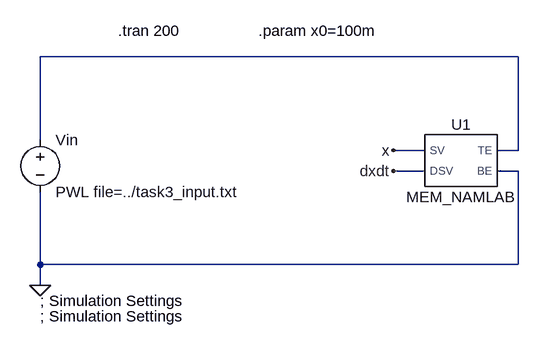
[diagram p0: schematic task3.asc]
task3.asc, the LTspice schematic file:
Version 4
SHEET 1 1352 680
WIRE 528 -160 -208 -160
WIRE -208 -32 -208 -160
WIRE 384 -16 336 -16
WIRE 528 -16 528 -160
WIRE 528 -16 496 -16
WIRE 384 16 336 16
WIRE 528 16 496 16
WIRE -208 160 -208 48
WIRE 528 160 528 16
WIRE 528 160 -208 160
WIRE -208 192 -208 160
FLAG -208 192 0
FLAG 336 -16 x
FLAG 336 16 dxdt
SYMBOL voltage -208 -48 R0
WINDOW 123 0 0 Left 0
WINDOW 39 0 0 Left 0
SYMATTR InstName Vin
SYMATTR Value PWL file=../task3_input.txt
SYMBOL MEM_NAMLAB 432 0 R0
SYMATTR InstName U1
TEXT -88 -200 Left 2 !.tran 200
TEXT 128 -200 Left 2 !.param x0=100m
TEXT -208 216 Left 2 !; Simulation Settings
TEXT -208 240 Left 2 !; Simulation Settings

The netlist it stands for:
* task3.asc
Vin N001 0 PWL file=../task3_input.txt
XU1 N001 0 x dxdt MEM_NAMLAB  ; pins TE BE SV DSV
.tran 200
.param x0=100m
; Simulation Settings
; Simulation Settings
.lib .\MEM_NAMLAB.cir
.backanno
.end

* Results of the author's LTspice run, read from the files saved beside the schematic
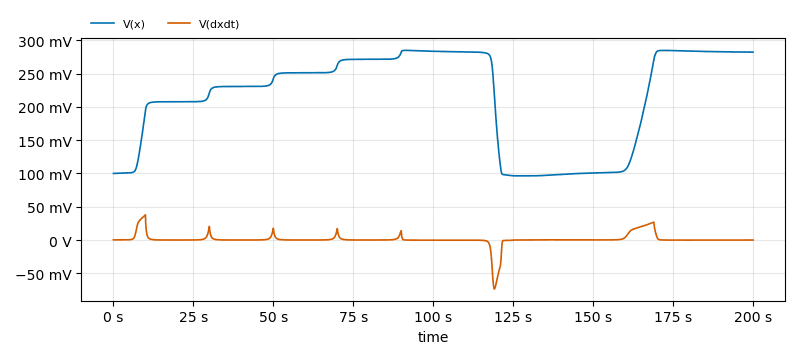
[diagram p1: Transient Analysis of task3.asc, plotted from the saved traces]
* Transient Analysis, 1 run:
*   V(x): min 96.4 mV, max 284.8 mV, average 215.4 mV, rms 227.3 mV, last 282.2 mV
*   V(dxdt): min -73.28 mV, max 37.83 mV, average 925.9 µV, rms 9.228 mV, last -44.93 µV